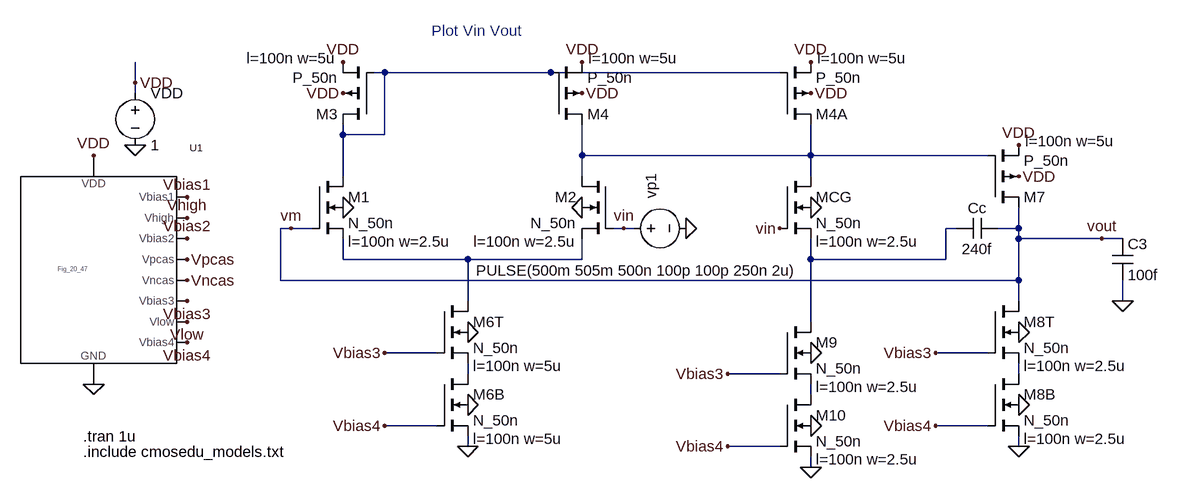
[diagram p0: schematic Fig24_20.asc]
Fig24_20.asc, the LTspice schematic file:
Version 4
SHEET 1 2448 680
WIRE 1248 -368 1232 -368
WIRE 1504 -368 1248 -368
WIRE 1856 -368 1504 -368
WIRE 864 -352 864 -384
WIRE 864 -336 864 -352
WIRE 1184 -272 1184 -288
WIRE 1248 -272 1248 -368
WIRE 1248 -272 1184 -272
WIRE 1552 -240 1552 -288
WIRE 1904 -240 1904 -288
WIRE 1904 -240 1552 -240
WIRE 2176 -240 1904 -240
WIRE 1184 -208 1184 -272
WIRE 1552 -208 1552 -240
WIRE 1904 -208 1904 -240
WIRE 1104 -128 1088 -128
WIRE 1136 -128 1104 -128
WIRE 1616 -128 1600 -128
WIRE 1632 -128 1616 -128
WIRE 2128 -128 2112 -128
WIRE 2224 -128 2224 -160
WIRE 2224 -128 2192 -128
WIRE 2224 -112 2224 -128
WIRE 2352 -112 2224 -112
WIRE 2384 -112 2352 -112
WIRE 1184 -80 1184 -112
WIRE 1376 -80 1184 -80
WIRE 1552 -80 1552 -112
WIRE 1552 -80 1376 -80
WIRE 1904 -80 1904 -112
WIRE 2112 -80 2112 -128
WIRE 2112 -80 1904 -80
WIRE 1088 -48 1088 -128
WIRE 2224 -48 2224 -112
WIRE 2224 -48 1088 -48
WIRE 1376 -16 1376 -80
WIRE 2224 -16 2224 -48
WIRE 2384 -16 2384 -48
WIRE 1904 16 1904 -80
WIRE 1328 64 1248 64
WIRE 2176 64 2096 64
WIRE 1376 96 1376 80
WIRE 1856 96 1776 96
WIRE 2224 96 2224 80
WIRE 1904 128 1904 112
WIRE 1328 176 1248 176
WIRE 2176 176 2096 176
WIRE 1376 208 1376 192
WIRE 1856 208 1776 208
WIRE 2224 208 2224 192
WIRE 1904 240 1904 224
FLAG 864 -256 0
FLAG 864 -352 VDD
FLAG 1552 -160 0
FLAG 1376 208 0
FLAG 1184 -160 0
FLAG 1552 -384 VDD
FLAG 1552 -336 VDD
FLAG 1184 -336 VDD
FLAG 800 -240 VDD
FLAG 800 112 0
FLAG 944 -176 Vbias1
FLAG 944 -144 Vhigh
FLAG 944 -112 Vbias2
FLAG 944 -16 Vbias3
FLAG 944 -80 Vpcas
FLAG 944 -48 Vncas
FLAG 944 48 Vbias4
FLAG 944 16 Vlow
FLAG 1184 -384 VDD
FLAG 1376 32 0
FLAG 1376 144 0
FLAG 1248 64 Vbias3
FLAG 1248 176 Vbias4
FLAG 1104 -128 vm
FLAG 1616 -128 vin
FLAG 2224 -256 VDD
FLAG 2224 -208 VDD
FLAG 2224 208 0
FLAG 2224 32 0
FLAG 2224 144 0
FLAG 2096 64 Vbias3
FLAG 2096 176 Vbias4
FLAG 2352 -112 vout
FLAG 2384 -16 0
FLAG 1904 -384 VDD
FLAG 1904 -336 VDD
FLAG 1904 -160 0
FLAG 1856 -128 vin
FLAG 1904 240 0
FLAG 1904 64 0
FLAG 1904 176 0
FLAG 1776 96 Vbias3
FLAG 1776 208 Vbias4
FLAG 1712 -128 0
SYMBOL voltage 864 -352 R0
WINDOW 123 0 0 Left 2
WINDOW 39 0 0 Left 2
SYMATTR InstName VDD
SYMATTR Value 1
SYMBOL nmos4 1600 -208 M0
WINDOW 123 56 100 Left 2
SYMATTR Value2 l=100n w=2.5u
SYMATTR InstName M2
SYMATTR Value N_50n
SYMBOL nmos4 1136 -208 R0
WINDOW 123 56 100 Left 2
SYMATTR Value2 l=100n w=2.5u
SYMATTR InstName M1
SYMATTR Value N_50n
SYMBOL pmos4 1504 -288 M180
WINDOW 123 58 102 Left 2
WINDOW 0 56 16 Left 2
SYMATTR Value2 l=100n w=5u
SYMATTR InstName M4
SYMATTR Value P_50n
SYMBOL pmos4 1232 -288 R180
WINDOW 123 58 102 Left 2
WINDOW 0 56 16 Left 2
SYMATTR Value2 l=100n w=5u
SYMATTR InstName M3
SYMATTR Value P_50n
SYMBOL Fig_20_47 800 -64 R0
SYMATTR InstName U1
SYMBOL nmos4 1328 -16 R0
WINDOW 123 56 100 Left 2
SYMATTR Value2 l=100n w=5u
SYMATTR InstName M6T
SYMATTR Value N_50n
SYMBOL nmos4 1328 96 R0
WINDOW 123 56 100 Left 2
SYMATTR Value2 l=100n w=5u
SYMATTR InstName M6B
SYMATTR Value N_50n
SYMBOL pmos4 2176 -160 M180
WINDOW 123 58 102 Left 2
WINDOW 0 56 16 Left 2
SYMATTR Value2 l=100n w=5u
SYMATTR InstName M7
SYMATTR Value P_50n
SYMBOL nmos4 2176 -16 R0
WINDOW 123 56 100 Left 2
SYMATTR Value2 l=100n w=2.5u
SYMATTR InstName M8T
SYMATTR Value N_50n
SYMBOL nmos4 2176 96 R0
WINDOW 123 56 100 Left 2
SYMATTR Value2 l=100n w=2.5u
SYMATTR InstName M8B
SYMATTR Value N_50n
SYMBOL cap 2192 -144 R90
WINDOW 0 0 32 VBottom 2
WINDOW 3 32 32 VTop 2
SYMATTR InstName Cc
SYMATTR Value 240f
SYMBOL cap 2368 -112 R0
SYMATTR InstName C3
SYMATTR Value 100f
SYMBOL pmos4 1856 -288 M180
WINDOW 123 58 102 Left 2
WINDOW 0 56 16 Left 2
SYMATTR Value2 l=100n w=5u
SYMATTR InstName M4A
SYMATTR Value P_50n
SYMBOL nmos4 1856 -208 R0
WINDOW 123 56 100 Left 2
SYMATTR Value2 l=100n w=2.5u
SYMATTR InstName MCG
SYMATTR Value N_50n
SYMBOL nmos4 1856 16 R0
WINDOW 123 56 100 Left 2
SYMATTR Value2 l=100n w=2.5u
SYMATTR InstName M9
SYMATTR Value N_50n
SYMBOL nmos4 1856 128 R0
WINDOW 123 56 100 Left 2
SYMATTR Value2 l=100n w=2.5u
SYMATTR InstName M10
SYMATTR Value N_50n
SYMBOL voltage 1616 -128 R270
WINDOW 0 45 42 Left 2
WINDOW 3 -65 -227 VRight 2
WINDOW 39 0 0 Left 2
SYMATTR InstName vp1
SYMATTR Value PULSE(500m 505m 500n 100p 100p 250n 2u)
SYMATTR Value2 AC 0
TEXT 784 216 Left 2 !.include cmosedu_models.txt
TEXT 1320 -432 Left 2 ;Plot Vin Vout
TEXT 784 192 Left 2 !.tran 1u

The netlist it stands for:
* Fig24_20.asc
VDD VDD 0 1
M2 N002 vin N004 0 N_50n l=100n w=2.5u
M1 N001 vout N004 0 N_50n l=100n w=2.5u
M4 N002 N001 VDD VDD P_50n l=100n w=5u
M3 N001 N001 VDD VDD P_50n l=100n w=5u
XU1 Vbias1 Vhigh Vbias2 Vpcas Vncas Vbias3 Vlow Vbias4 VDD 0 Fig_20_47  ; pins Vbias1 Vhigh Vbias2 Vpcas Vncas Vbias3 Vlow Vbias4 VDD GND
M6T N004 Vbias3 N005 0 N_50n l=100n w=5u
M6B N005 Vbias4 0 0 N_50n l=100n w=5u
M7 vout N002 VDD VDD P_50n l=100n w=5u
M8T vout Vbias3 N006 0 N_50n l=100n w=2.5u
M8B N006 Vbias4 0 0 N_50n l=100n w=2.5u
Cc vout N003 240f
C3 vout 0 100f
M4A N002 N001 VDD VDD P_50n l=100n w=5u
MCG N002 vin N003 0 N_50n l=100n w=2.5u
M9 N003 Vbias3 N007 0 N_50n l=100n w=2.5u
M10 N007 Vbias4 0 0 N_50n l=100n w=2.5u
vp1 vin 0 PULSE(500m 505m 500n 100p 100p 250n 2u) AC 0
.model NMOS NMOS
.model PMOS PMOS
.lib standard.mos
.include cmosedu_models.txt
* Plot Vin Vout
.tran 1u
.backanno
.end